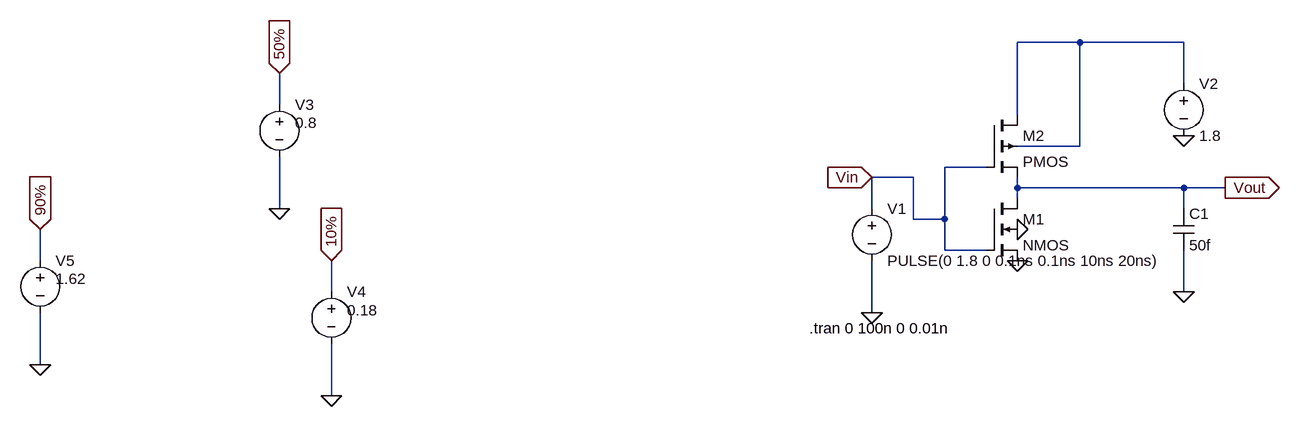
[diagram p0: schematic 180 transisent inverter.asc]
180 transisent inverter.asc, the LTspice schematic file:
Version 4.1
SHEET 1 880 680
WIRE 272 -80 176 -80
WIRE 432 -80 272 -80
WIRE 432 -16 432 -80
WIRE -960 16 -960 -32
WIRE 176 32 176 -80
WIRE 272 80 272 -80
WIRE 272 80 176 80
WIRE 128 112 64 112
WIRE 16 128 -48 128
WIRE 176 144 176 128
WIRE 432 144 176 144
WIRE 496 144 432 144
WIRE 176 160 176 144
WIRE -960 176 -960 96
WIRE -48 176 -48 128
WIRE 432 176 432 144
WIRE 16 192 16 128
WIRE 64 192 64 112
WIRE 64 192 16 192
WIRE 64 240 64 192
WIRE 128 240 64 240
WIRE -1328 256 -1328 208
WIRE -880 304 -880 256
WIRE 432 304 432 240
WIRE -48 336 -48 256
WIRE -1328 416 -1328 336
WIRE -880 464 -880 384
FLAG -48 336 0
FLAG 432 64 0
FLAG 176 256 0
FLAG 176 208 0
FLAG 432 304 0
FLAG -48 128 Vin
IOPIN -48 128 In
FLAG 496 144 Vout
IOPIN 496 144 Out
FLAG -960 176 0
FLAG -960 -32 50%
IOPIN -960 -32 In
FLAG -880 464 0
FLAG -880 256 10%
IOPIN -880 256 In
FLAG -1328 416 0
FLAG -1328 208 90%
IOPIN -1328 208 In
SYMBOL nmos4 128 160 R0
SYMATTR InstName M1
SYMATTR Value2 l=180nm w=270nm
SYMBOL pmos4 128 32 R0
SYMATTR InstName M2
SYMATTR Value2 l=180nm w=810nm
SYMBOL cap 416 176 R0
SYMATTR InstName C1
SYMATTR Value 50f
SYMBOL voltage -48 160 R0
WINDOW 123 0 0 Left 0
WINDOW 39 0 0 Left 0
SYMATTR InstName V1
SYMATTR Value PULSE(0 1.8 0 0.1ns 0.1ns 10ns 20ns)
SYMBOL voltage 432 -32 R0
WINDOW 123 0 0 Left 0
WINDOW 39 0 0 Left 0
SYMATTR InstName V2
SYMATTR Value 1.8
SYMBOL voltage -960 0 R0
WINDOW 123 0 0 Left 0
WINDOW 39 0 0 Left 0
WINDOW 3 24 44 Left 2
SYMATTR Value 0.8
SYMATTR InstName V3
SYMBOL voltage -880 288 R0
WINDOW 123 0 0 Left 0
WINDOW 39 0 0 Left 0
WINDOW 3 24 44 Left 2
SYMATTR Value 0.18
SYMATTR InstName V4
SYMBOL voltage -1328 240 R0
WINDOW 123 0 0 Left 0
WINDOW 39 0 0 Left 0
WINDOW 3 24 44 Left 2
SYMATTR Value 1.62
SYMATTR InstName V5
TEXT -144 360 Left 2 !.tran 0 100n 0 0.01n

The netlist it stands for:
* 180 transisent inverter.asc
M1 Vout Vin 0 0 NMOS l=180nm w=270nm
M2 N001 Vin Vout N001 PMOS l=180nm w=810nm
C1 Vout 0 50f
V1 Vin 0 PULSE(0 1.8 0 0.1ns 0.1ns 10ns 20ns)
V2 N001 0 1.8
V3 50% 0 0.8
V4 10% 0 0.18
V5 90% 0 1.62
.model NMOS NMOS
.model PMOS PMOS
.lib standard.mos
.tran 0 100n 0 0.01n
.backanno
.end